# EAGLE design GainBlock (EAGLE 6.5.0)
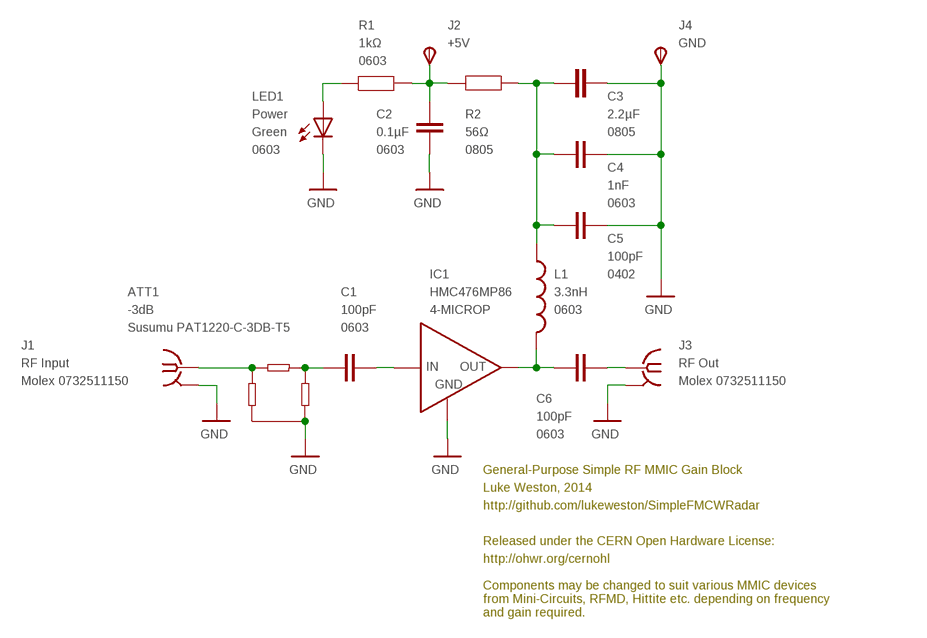
[diagram p0: schematic, sheet 1]

## Parts
ATT1  -3dB  PAT1220  [PAT1220]
C1  100pF  CAPACITOR0603  [0603]
C2  0.1µF  CAPACITOR0603  [0603]
C3  2.2µF  CAP0805  [0805]
C4  1nF  CAPACITOR0603  [0603]
C5  100pF  CAPACITOR0402  [0402]
C6  100pF  CAPACITOR0603  [0603]
IC1  HMC476MP86  ERA-2SM+  [WW107]
J1  RF Input  SMA-142-0701-881/886  [J502-ND-142-0701-881/886]
J2  TPSPAD1-13  [P1-13]
J3  RF Out  SMA-142-0701-881/886  [J502-ND-142-0701-881/886]
J4  TPSPAD1-13  [P1-13]
L1  3.3nH  INDUCTOR0603  [0603]
LED1  Power  LED0603  [LED-0603]
R1  1kΩ  RESISTOR0603  [0603]
R2  56Ω  RESISTOR0805  [0805]

## Nets
GND: ATT1.3 C2.2 C3.1 C4.2 C5.2 IC1.2(GND) IC1.4(GND) J1.G@1(GND) J3.G@1(GND) J4.TP(PP) LED1.C
N$1: ATT1.1 J1.1
N$2: ATT1.2 C1.1
N$3: LED1.A R1.1
N$5: C6.2 J3.1
N$6: C1.2 IC1.1(IN)
N$7: C6.1 IC1.3(OUT) L1.2
N$8: C3.2 C4.1 C5.1 L1.1 R2.1
N$9: C2.1 J2.TP(PP) R1.2 R2.2

## Notes on the sheet
- General-Purpose Simple RF MMIC Gain Block
- Luke Weston, 2014
- http://github.com/lukeweston/SimpleFMCWRadar
- Released under the CERN Open Hardware License:
- http://ohwr.org/cernohl
- Components may be changed to suit various MMIC devices
  from Mini-Circuits, RFMD, Hittite etc. depending on frequency
  and gain required.

## Power pins joined to a net without a drawn wire
GND: J1.G@2(GND) J1.G@3(GND) J1.G@4(GND) J3.G@2(GND) J3.G@3(GND) J3.G@4(GND)

## Library data of the parts
ATT1 = freetronics-luke:PAT1220: Susumu PAT1220 SMD chip attenuator; ID: Susumu PAT1220-C-3DB-T5
C1 C2 C4 C6 = freetronics-luke:CAPACITOR; PACKAGE: 0603
C3 = freetronics-master-v1:CAP: Capacitor Standard 0603 ceramic capacitor, and 0.1" leaded capacitor.; PACKAGE: 0805; VOLTAGE: 10V
C5 = freetronics-luke:CAPACITOR; PACKAGE: 0402
IC1 = freetronics-luke:ERA-2SM+: Mini-Circuits ERA-2SM+ MMIC amplifier; PACKAGE: 4-MICROP
J1 J3 = con-coax:SMA-: SMA 50 Ohm End Launch Jack Receptacle - Round Contact Johnson Components Source: www.johnsoncomponents.com .. J502-ND.pdf; ID: Molex 0732511150; MF: JOHNSON COMPONENTS; MPN: 142-0701-881; OC_FARNELL: 1608603; OC_NEWARK: 08B906
J2 = testpad:TPS: TEST PIN; TP_SIGNAL_NAME: +5V
J4 = testpad:TPS: TEST PIN; TP_SIGNAL_NAME: GND
L1 = freetronics-master-v1:INDUCTOR: Inductors Basic Inductor/Choke - 0603 and 1206. Footprints are not proven and vary greatly between part numbers.; ID: HK160822NJ-T; PACKAGE: 0603
LED1 = freetronics-master-v1:LED: LEDs Standard schematic elements and footprints for 5mm, 3mm, 1206, and 0603 sized LEDs. 5mm - Spark Fun Electronics SKU : COM-00529 (and others); COLOR: Green; PACKAGE: 0603
R1 = freetronics-master-v1:RESISTOR: Resistor Basic schematic elements and footprints for 0603, 1206, and PTH 1/10th watt (small) resistors.; PACKAGE: 0603
R2 = freetronics-master-v1:RESISTOR: Resistor Basic schematic elements and footprints for 0603, 1206, and PTH 1/10th watt (small) resistors.; PACKAGE: 0805

## Net classes
4 RF Antenna: width 0.305 mm
5 GND: width 0.203 mm

## Board
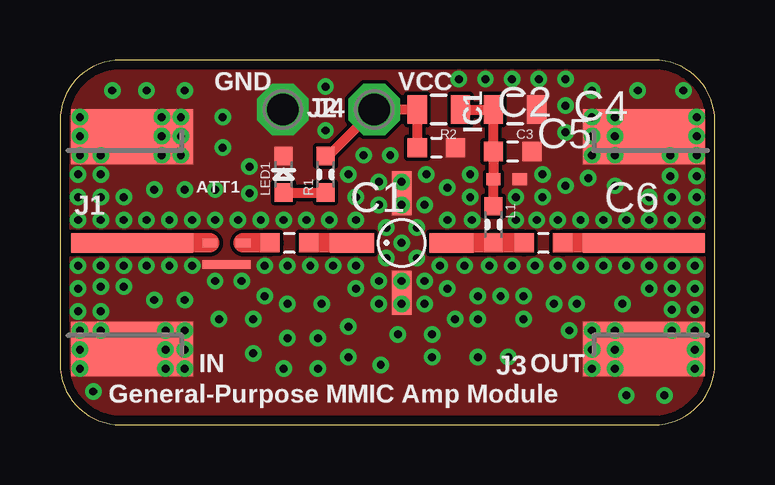
[diagram p1: board, top side]
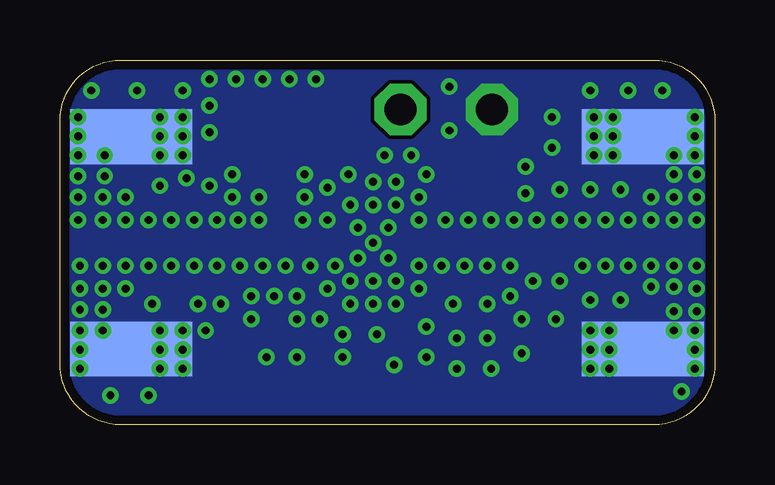
[diagram p2: board, bottom side, seen from below]

Size 27.3 x 15.2 mm. Coordinates in mm from the lower left corner, seen from the top.
Outline: 0,2.54 arc90 2.54,0 24.76,0 arc90 27.3,2.54 27.3,12.66 arc90 24.76,15.2 2.54,15.2 arc90 0,12.66 0,2.54
Copper layers (1*16): Top 0.0356mm / dielectric 1.5011mm / Bottom 0.0356mm
Design rules "LaenPCBOrder *": minimum track width 6mil, minimum drill 13mil, track to track 6mil, track to pad 6mil, pad to pad 6mil, via to via 6mil, smd to smd 6mil, copper to edge 15mil, drill to drill 6mil, minimum pad ring 7mil, minimum via ring 7mil, stop-mask expansion 3mil, vias tented up to drill 14mil, thermal gap 10mil

### Footprints (pad centres in the part's own frame; a part is rotated, then mirrored left to right if it is on the bottom)
PAT1220 = smd 0.6 x 0.35: 1 -0.7,0.45; 2 0.7,0.45 | smd 2 x 0.35: 3 0,-0.45
0603 = smd 0.8 x 0.8: 1 -0.8,0; 2 0.8,0
0805 = smd 0.8 x 1.2: 1 -0.9,0; 2 0.9,0
0402 = smd 0.6 x 0.5: 1 -0.55,0; 2 0.55,0
WW107 = smd 0.813 x 1.829: 1 0,-2.07; 3 0,2.07 | smd 1.829 x 0.813: 2 2.07,0; 4 -2.07,0
J502-ND-142-0701-881/886 = smd 5.08 x 0.813: 1 2.565,0 | smd 5.08 x 2.286: G@1 2.565,4.42; G@2 2.565,-4.42 | smd 5.08 x 2.286 bottom: G@3 2.565,4.42; G@4 2.565,-4.42
P1-13 = drill 1.321 pad 2.159 octagon: TP 0,0
0603' = smd 0.762 x 0.762: 1 -0.762,0; 2 0.762,0
LED-0603 = smd 0.762 x 0.762: A -0.762,0; C 0.762,0

### Placement (x,y rotation side)
ATT1  6.95,7.13 0 top
C1  9.56,7.58 0 top
C2  15.7,11.55 0 top
C3  18.97,13.14 180 top
C4  18.87,11.39 0 top
C5  18.62,10.24 0 top
C6  20.16,7.58 0 top
IC1  14.25,7.58 270 top
J1  0.44,7.58 0 top
J2  13.1,13.14 0 top
J3  26.91,7.58 180 top
J4  9.29,13.14 0 top
L1  3.3nH  [0603']  18.07,8.34 270 top
LED1  9.33,10.44 90 top
R1  1kΩ  [0603']  11.07,10.44 90 top
R2  15.8,13.14 180 top

### Tracks (layer width: path | path; a pad name or v marks a point on that pad's centre or on a via)
GND  (via drill 0.33)
  other vias: 12.34,8.53 14.25,7.58 14.88,8.22 13.61,6.95 13.61,8.22 14.88,6.95 13.3,5.99 12.34,6.63 13.3,9.17 13.3,10.12 12.34,9.49 11.39,6.63 15.2,9.17 15.28,10.44 16.15,8.53 17.18,8.53 14.25,10.12 15.84,6.63 15.2,5.99 16.15,5.68 16.87,6.63 14.25,5.99 15.2,5.04 13.3,5.04 12.34,5.68 14.25,9.17 16.63,14.41 11.07,14.09 1.71,11.23 0.83,11.23 0.83,12.03 0.83,12.82 5.04,11.23 1.71,9.49 11.07,12.26 12.03,10.44 13.77,11.23 9.33,8.53 16.15,9.88 17.11,10.44 17.11,9.49 23.14,12.82 22.19,13.93 21.07,13.3 22.19,12.82 17.74,14.41 10.28,8.53 18.85,14.41 21.07,12.18 19.96,14.41 21.07,14.41 22.03,10.28 22.19,11.23 23.14,11.23 24.09,13.93 11.23,8.53 25.44,10.36 25.44,11.23 26.55,10.36 26.55,11.23 26,13.93 26.55,12.82 26.55,12.03 21.07,9.96 6.47,8.53 1.71,8.53 1.71,10.44 5.52,8.53 7.42,8.53 8.37,8.53 24.57,8.53 20.76,8.53 20.12,9.49 19.01,9.49 19.01,8.53 19.88,8.53 20.12,10.44 21.71,8.53 22.66,8.53 26.55,8.53 25.52,8.53 23.61,8.53 24.57,9.49 25.52,9.49 0.75,6.63 26.55,9.49 22.19,3.93 22.66,6.63 26.47,6.63 17.9,6.63 18.85,6.63 19.8,6.63 20.76,6.63 21.71,6.63 0.75,4.72 0.83,2.34 0.83,3.93 4.56,6.63 1.71,4.72 1.71,3.93 0.83,3.14 3.61,8.53 23.14,3.93 5.2,3.93 8.53,6.63 6.47,5.99 5.52,6.63 9.49,6.63 10.44,6.63 8.53,5.36 7.58,5.99 23.61,6.63 16.47,4.41 14.09,3.77 17.42,5.36 1.71,5.75 15.52,3.77 2.66,8.53 4.41,3.14 19.33,5.36 4.41,3.93 24.57,5.68 24.57,6.63 25.52,6.63 21.23,3.93 25.52,5.68 18.38,5.36 19.33,4.41 25.52,4.8 25.52,3.93 26.47,2.34 26.47,5.68 26.47,4.8 26.47,3.93 26.47,3.14 20.6,5.04 23.46,5.04 22.19,2.34 23.14,2.34 21.55,5.04 17.42,4.41 12.66,11.23 23.14,3.14 14.25,5.04 23.14,9.96 15.52,2.82 17.42,2.82 2.66,9.49 5.2,2.34 5.2,3.14 22.19,3.14 18.69,2.82 13.37,2.5 22.19,12.03 23.14,12.03 1.71,6.63 2.66,6.63 4.41,2.34 3.61,6.63 2.66,5.75 0.75,8.53 0.75,10.44 0.75,9.49 0.75,5.68 4.56,8.53 4.25,11.23 4.25,12.03 4.25,12.82 5.04,12.82 5.04,12.03 2.18,13.93 3.61,13.93 5.2,13.93 6.79,12.82 6.79,11.55 7.9,10.76 7.9,9.64 6.47,9.8 5.2,9.8 3.93,5.2 5.2,5.2 6.63,4.41 8.06,4.41 9.49,5.04 10.91,5.04 12.03,4.09 12.03,2.82 10.76,3.61 9.49,3.61 8.06,2.98 9.33,2.34 10.76,2.34 3.93,9.8 23.61,1.23 25.2,1.23 1.39,1.39
  pour Top (isolate 0.152, no thermals): -0.23,15.36 27.58,15.36 27.58,-0.2 -0.23,-0.2
  pour Bottom (isolate 0.152, no thermals): -0.23,15.36 27.58,15.36 27.58,-0.2 -0.23,-0.2
N$1
  Top 0.813: J1.1 ATT1.1
N$2
  Top 0.813: ATT1.2 C1.1
N$3
  Top 0.406: LED1.A R1.1
N$5
  Top 0.813: J3.1 C6.2
N$6
  Top 0.813: C1.2 IC1.1
N$7
  Top 0.813: IC1.3 L1.2 C6.1
N$8
  Top 0.406: L1.1 C5.1 C4.1 C3.2 R2.1
N$9
  Top 0.254: R1.2 11.17,11.2
  Top 0.406: C2.1 R2.2 J2.TP 11.17,11.2

### Text on the board
tPlace: GND | VCC | IN | OUT | General-Purpose MMIC Amp Module